# EAGLE design Soccer_Robot V1.1R (EAGLE 9.5.1)
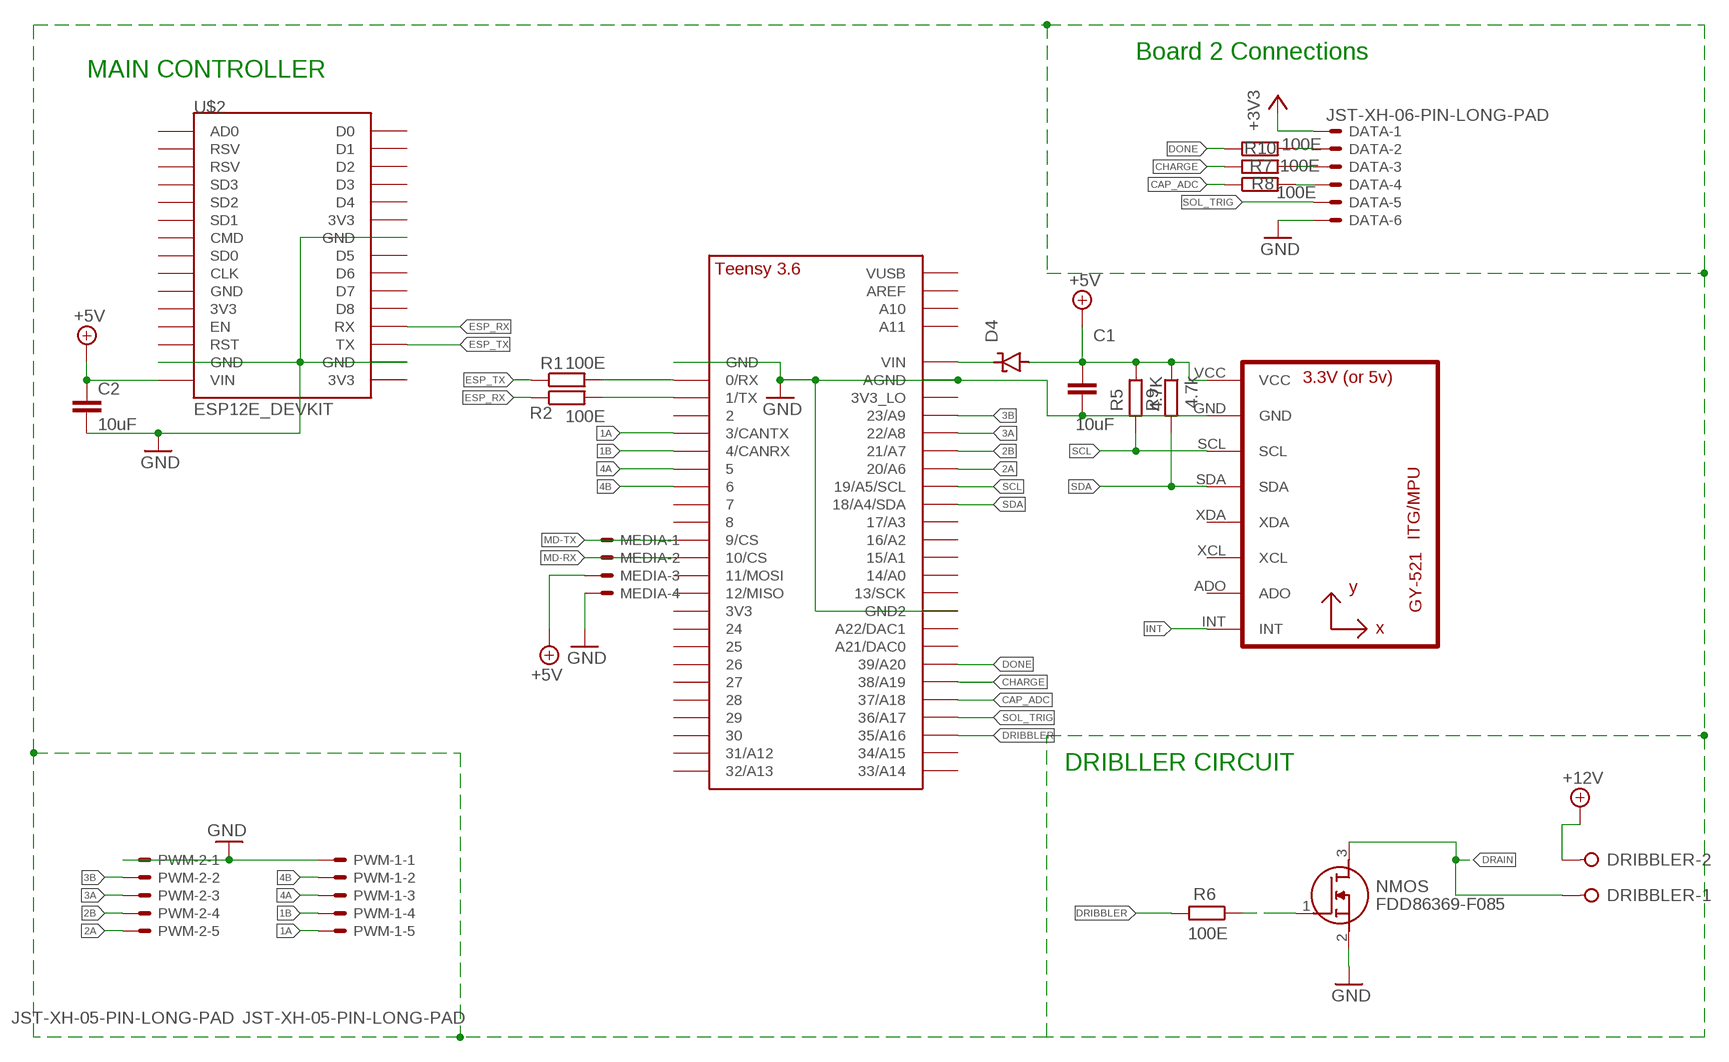
[diagram p0: schematic, sheet 1, part 1 of 2]
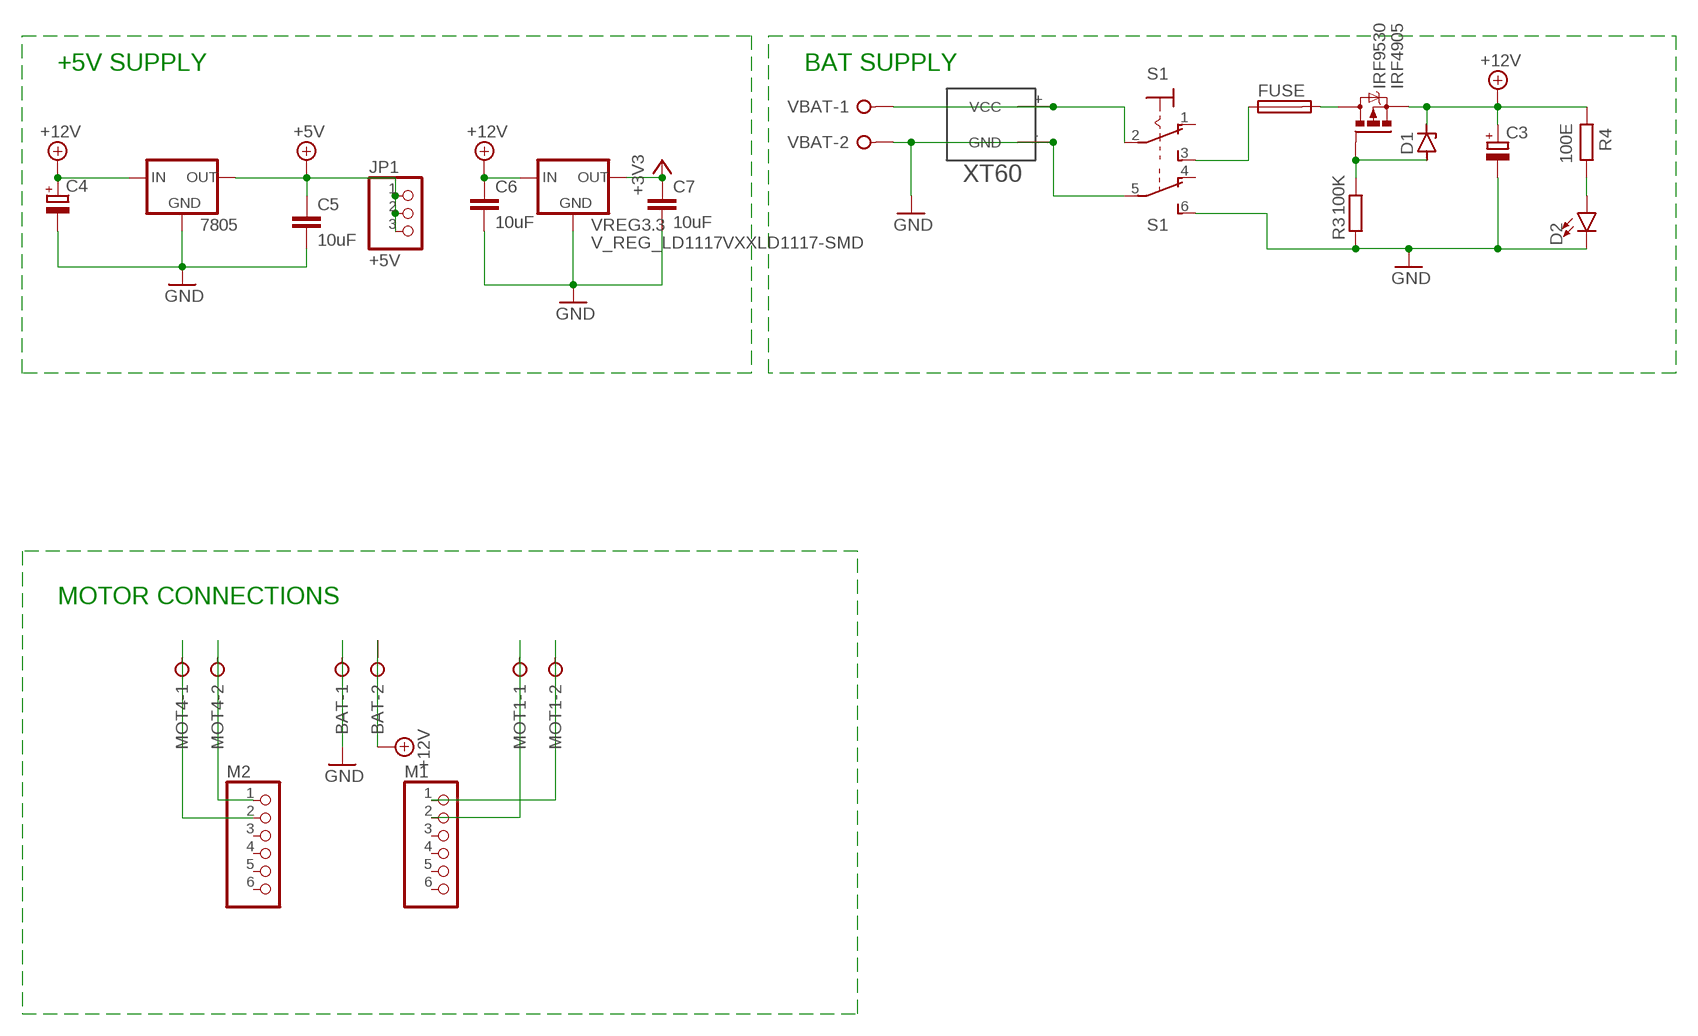
[diagram p1: schematic, sheet 1, part 2 of 2]

## Parts
7805  78XXS  [78XXS]
BAT  W237-02P  [W237-132]
C1  10uF  C-EUC1206  [C1206]
C2  10uF  C-EUC1206  [C1206]
C3  CPOL-EUE2.5-7  [E2,5-7]
C4  CPOL-EUE2.5-7  [E2,5-7]
C5  10uF  C-EUC1206  [C1206]
C6  10uF  C-EUC1206  [C1206]
C7  10uF  C-EUC1206  [C1206]
D1  ZENER-DIODEDO41Z10  [DO41Z10]
D2  LED5MM  [LED_5MM]
D4  SUPPRESSOR-SMBG  [SMBG]
DATA  JST-XH-06-PIN-LONG-PAD  [JST-XH-06-PACKAGE-LONG-PAD]
DRIBBLER  W237-02P  [W237-132]
FUSE  SH22,5A  [SH22,5A]
IRF4905  IRF9530  [TO220BV]
JP1  +5V  PINHD-1X3  [1X03]
M1  PINHD-1X6  [1X06]
M2  PINHD-1X6  [1X06]
MEDIA  JST-XH-04-PIN-LONG-PAD  [JST-XH-04-PACKAGE-LONG-PAD]
MOT1  W237-02P  [W237-132]
MOT4  W237-02P  [W237-132]
NMOS  FDD86369-F085  [DPAK3-CASE-369AS]
PWM-1  JST-XH-05-PIN-LONG-PAD  [JST-XH-05-PACKAGE-LONG-PAD]
PWM-2  JST-XH-05-PIN-LONG-PAD  [JST-XH-05-PACKAGE-LONG-PAD]
R1  100E  R-EU_M1206  [M1206]
R2  100E  R-EU_M1206  [M1206]
R3  100K  R-EU_M1206  [M1206]
R4  100E  R-EU_M1206  [M1206]
R5  4.7K  R-EU_M1206  [M1206]
R6  100E  R-EU_M1206  [M1206]
R7  100E  R-EU_M1206  [M1206]
R8  100E  R-EU_M1206  [M1206]
R9  4.7k  R-EU_M1206  [M1206]
R10  100E  R-EU_M1206  [M1206]
S1  320-938  [320-938]
U1  GY-521MPU6050  [GY-521]
U$1  TEENSY_3.5/3.6_BASIC  [TEENSY_3.5/3.6_BASIC]
U$2  ESP12E_DEVKIT  [ESP12E_DEVKIT]
VBAT  W237-02P  [W237-132]
VBAT2  XT60  [XT60]
VREG3.3  V_REG_LD1117VXXLD1117-SMD  [SOT223]

## Nets
1A: PWM-1.5 U$1.3/CANTX
1B: PWM-1.4 U$1.4/CANRX
2A: PWM-2.5 U$1.20/A6
2B: PWM-2.4 U$1.21/A7
3A: PWM-2.3 U$1.22/A8
3B: PWM-2.2 U$1.23/A9
4A: PWM-1.3 U$1.5
4B: PWM-1.2 U$1.6
+3V3: C7.1 DATA.1 VREG3.3.2(OUT) VREG3.3.4(OUT)
+5V: 7805.OUT C1.1 C2.1 C5.1 D4.A JP1.1 JP1.2 JP1.3 MEDIA.3 R5.1 R9.1 U1.VCC U$2.VIN
+12V: 7805.IN BAT.2 C3.+ C4.+ C6.1 D1.C DRIBBLER.2 IRF4905.S R4.2 VREG3.3.3(IN)
CAP_ADC: R8.1 U$1.37/A18
CHARGE: R7.1 U$1.38/A19
DONE: R10.1 U$1.39/A20
DRAIN: DRIBBLER.1 NMOS.3(D)
DRIBBLER: R6.2 U$1.35/A16
ESP_RX: R2.1 U$2.RX
ESP_TX: R1.1 U$2.TX
GND: 7805.GND BAT.1 C1.2 C2.2 C3.- C4.- C5.2 C6.2 C7.2 D2.K(C) DATA.6 MEDIA.4 NMOS.2(S) PWM-1.1 PWM-2.1 R3.1 S1.5(B:P) S1.6(B:S) U1.GND U$1.AGND U$1.GND U$1.GND2 U$2.GND@1(GND) U$2.GND@2(GND) U$2.GND@3(GND) VBAT2.-(GND) VBAT.2 VREG3.3.1(GND)
INT: U1.INT
MD-RX: MEDIA.2 U$1.10/CS
MD-TX: MEDIA.1 U$1.9/CS
N$2: R1.2 U$1.0/RX
N$3: R2.2 U$1.1/TX
N$4: DATA.2 R10.2
N$7: S1.2(1:P) VBAT2.+(VCC) VBAT.1
N$8: FUSE.2 IRF4905.D
N$16: NMOS.1(G) R6.1
N$19: D1.A IRF4905.G R3.2
N$26: D2.A R4.1
N$29: M1.1 MOT1.2
N$30: M1.2 MOT1.1
N$31: M2.1 MOT4.2
N$70: M2.2 MOT4.1
N$72: FUSE.1 S1.3(1:S)
N$73: DATA.3 R7.2
N$74: DATA.4 R8.2
N$75: D4.C U$1.VIN
SCL: R5.2 U1.SCL U$1.19/A5/SCL
SDA: R9.2 U1.SDA U$1.18/A4/SDA
SOL_TRIG: DATA.5 U$1.36/A17
Unconnected: M1.3 M1.4 M1.5 M1.6 M2.3 M2.4 M2.5 M2.6 S1.1(1:O) S1.4(B:O) U1.ADO U1.XCL U1.XDA U$1.2 U$1.3V3 U$1.3V3_LO U$1.7 U$1.8 U$1.11/MOSI U$1.12/MISO U$1.13/SCK U$1.14/A0 U$1.15/A1 U$1.16/A2 U$1.17/A3 U$1.21/DAC0(A21/DAC0) U$1.24 U$1.25 U$1.26 U$1.27 U$1.28 U$1.29 U$1.30 U$1.31/A12 U$1.32/A13 U$1.33/A14 U$1.34/A15 U$1.A10 U$1.A11 U$1.A22/DAC1 U$1.AREF U$1.VUSB U$2.3V3@0(3V3) U$2.3V3@1(3V3) U$2.3V3@2(3V3) U$2.AD0 U$2.CLK U$2.CMD U$2.D0 U$2.D1 U$2.D2 U$2.D3 U$2.D4 U$2.D5 U$2.D6 U$2.D7 U$2.D8 U$2.EN U$2.GND@0(GND) U$2.RST U$2.RSV@0(RSV) U$2.RSV@1(RSV) U$2.SD0 U$2.SD1 U$2.SD2 U$2.SD3

## Notes on the sheet
- Board 2 Connections
- MAIN CONTROLLER
- +5V SUPPLY | BAT SUPPLY
- MOTOR CONNECTIONS
- DRIBLLER CIRCUIT

## Library data of the parts
7805 = v-reg:78XXS: VOLTAGE REGULATOR
BAT DRIBBLER MOT1 MOT4 VBAT = con-wago-508:W237-02P: WAGO SREW CLAMP; OC_FARNELL: unknown; OC_NEWARK: unknown
C1 C2 C5-C7 = rcl:C-EU: CAPACITOR, European symbol; SPICEPREFIX: C
C3 C4 = rcl:CPOL-EU: POLARIZED CAPACITOR, European symbol; SPICEPREFIX: C
D1 = diode:ZENER-DIODE: Z-Diode
D2 = SparkFun-LED:LED: LED (Generic) Standard schematic elements and footprints for 5mm, 3mm, 1206, and 0603 sized LEDs. Generic LEDs with no color specified.
D4 = diode:SUPPRESSOR-: Suppressor diode
DATA = Rembrandt Electronics - JST XH Connectors v1-0:JST-XH-06-PIN: JST XH Connector 2 Pin Wire to board connector. Pitch: 2,54 mm, (0.100") Number of pins: 6 Created by Rembrandt Electronics www.rembrandtelectronics.com
FUSE = fuse:SH22,5A: FUSE HOLDER grid 22,5mm, isolated cap OGN0031 8201, Schurter (Buerklin); MPN: 0031.7701.11; OC_FARNELL: unknown; OC_NEWARK: 04F1224
IRF4905 = transistor-power:IRF9530: P-CHANNEL HEXFET POWER-MOS-FET Source: http://www.irf.com/product-info/datasheets/data/irf9530.pdf
JP1 = pinhead:PINHD-1X3: PIN HEADER
M1 M2 = pinhead:PINHD-1X6: PIN HEADER
MEDIA = Rembrandt Electronics - JST XH Connectors v1-0:JST-XH-04-PIN: JST XH Connector 2 Pin Wire to board connector. Pitch: 2,54 mm, (0.100") Number of pins: 4 Created by Rembrandt Electronics www.rembrandtelectronics.com
NMOS = FDD86369-F085:FDD86369-F085: MOSFET 80V 90A Dual DPAK N-Chnl PowerTrench Source: Datasheet <https://componentsearchengine.com/Datasheets/1/FDD86369-F085.pdf>; DESCRIPTION: MOSFET 80V 90A Dual DPAK N-Chnl PowerTrench; HEIGHT: mm; MANUFACTURER_NAME: ON Semiconductor; MANUFACTURER_PART_NUMBER: FDD86369-F085; MOUSER_PART_NUMBER: 512-FDD86369_F085; MOUSER_PRICE-STOCK: https://www.mouser.com/Search/Refine.aspx?Keyword=512-FDD86369_F085
PWM-1 PWM-2 = Rembrandt Electronics - JST XH Connectors v1-0:JST-XH-05-PIN: JST XH Connector 2 Pin Wire to board connector. Pitch: 2,54 mm, (0.100") Number of pins: 5 Created by Rembrandt Electronics www.rembrandtelectronics.com
R1-R10 = rcl:R-EU_: RESISTOR, European symbol; SPICEPREFIX: R
S1 = switch:320-938: TOGGLE SWITCH distributor RS Components
U1 = gy-521:GY-521
U$1 = Teensy356:TEENSY_3.5/3.6_BASIC
U$2 = ESP12E_DEVKIT:ESP12E_DEVKIT: ESP12E DEVKIT BOARD
VBAT2 = XT60:XT60: XT60
VREG3.3 = SparkFun-IC-Power:V_REG_LD1117VXX: LD1117VXX voltage regulator. We carry the 3.3V version (COM-00526) in TO-220 package.; PROD_ID: VREG-13917

## Board
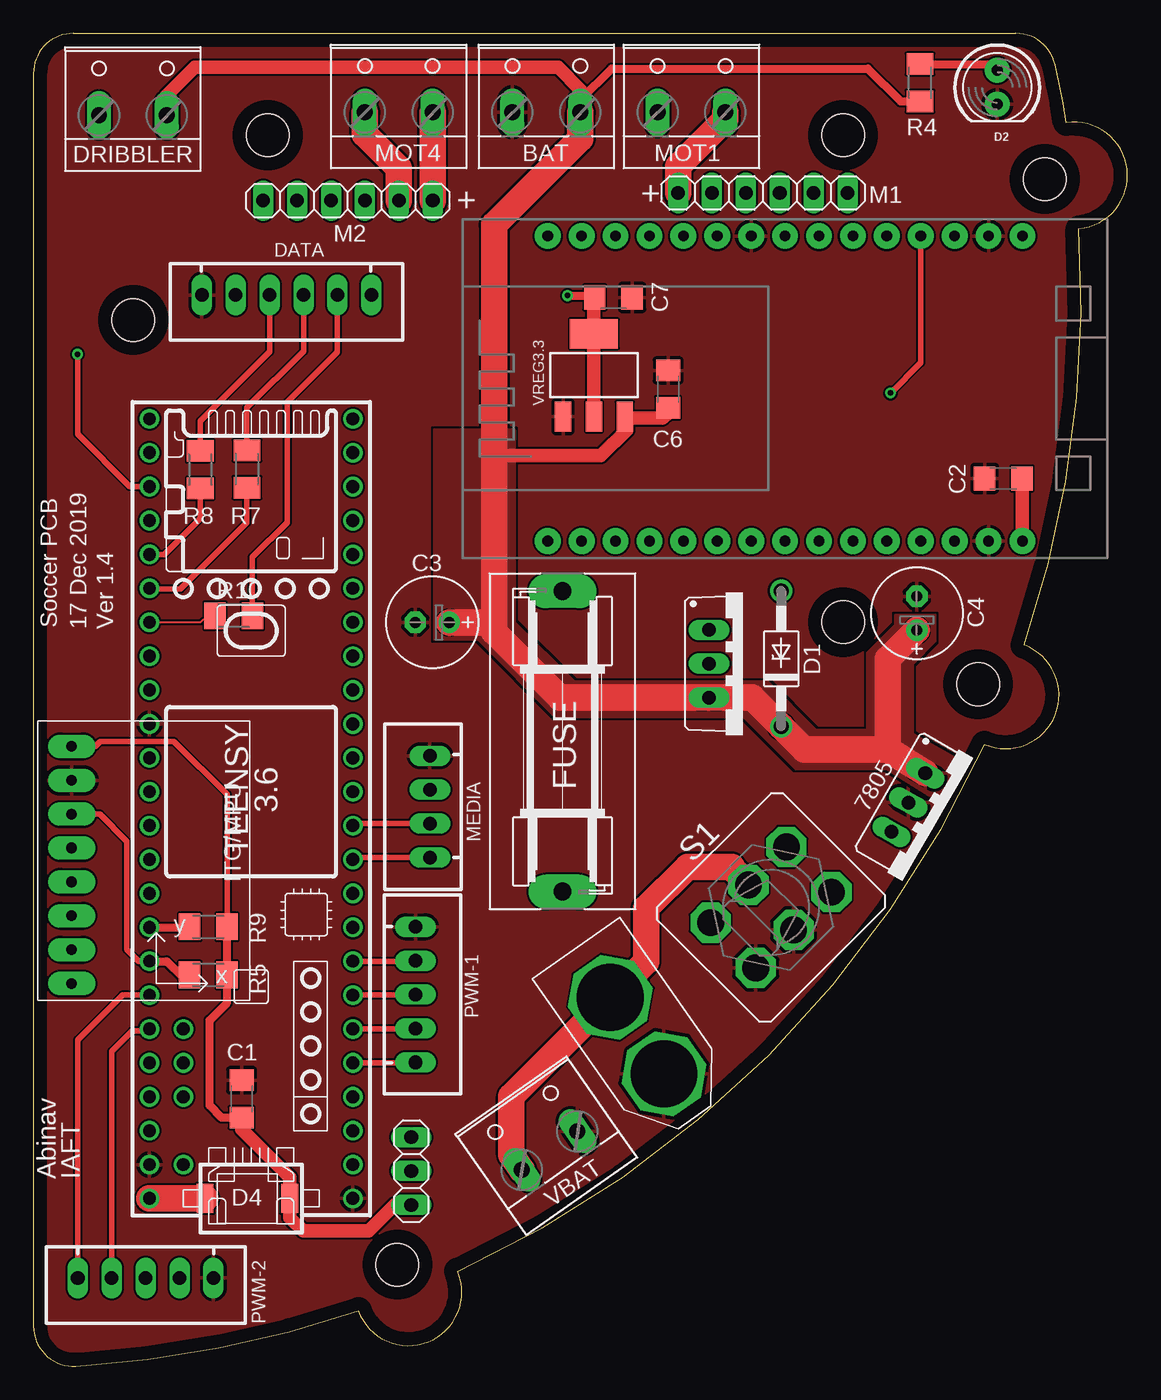
[diagram p2: board, top side]
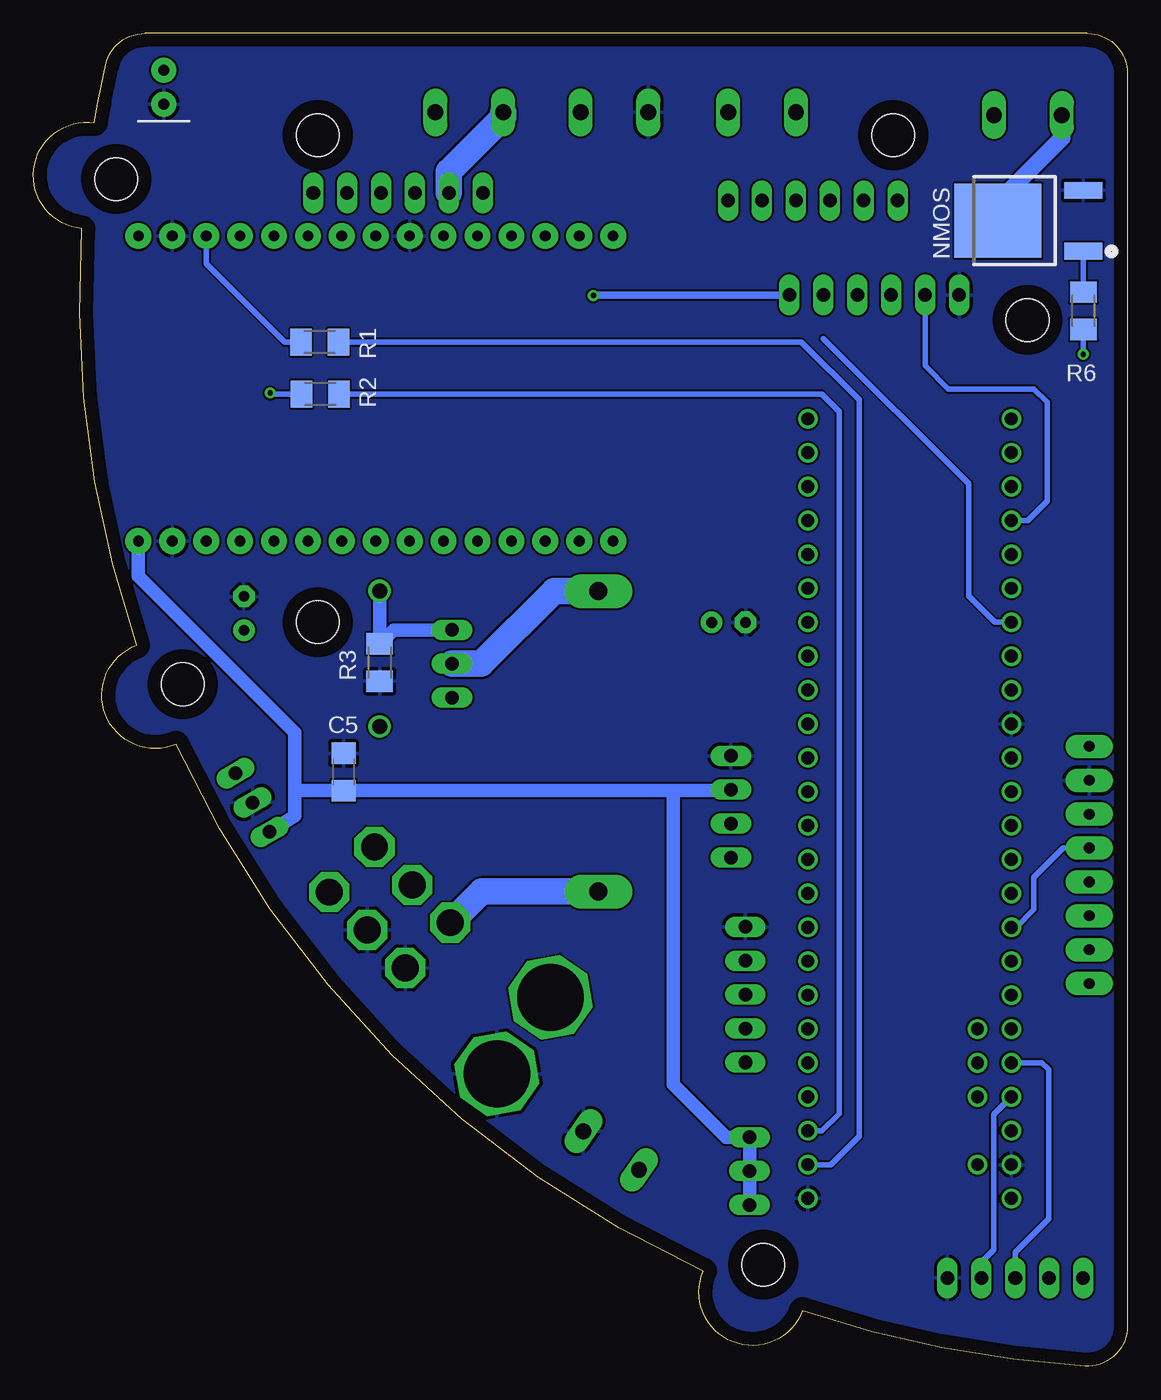
[diagram p3: board, bottom side, seen from below]

Size 81.95 x 99.87 mm. Coordinates in mm from the lower left corner, seen from the top.
Outline: 77.38,93.17 arc3 76.53,97.53 arc77 73.6,99.87 3,99.87 arc90 0,96.87 0,3 arc93 3.17,0 arc15 24.34,4.16 arc183 31.77,7.11 arc41 71.25,46.59 arc183 74.21,54.03 arc23 78.32,85.23 arc183 77.38,93.17
Copper layers (1*16): Top 0.035mm / dielectric 1.5mm / Bottom 0.035mm
Design rules "default *": minimum track width 6mil, minimum drill 0.35mm, track to track 6mil, track to pad 6mil, pad to pad 6mil, via to via 6mil, smd to smd 6mil, copper to edge 40mil, drill to drill 6mil, minimum pad ring 10mil, minimum via ring 8mil, stop-mask expansion 6mil, vias tented up to drill 0mil, thermal gap 10mil
Holes 3.2 mm at 7.49,78.39 60.65,92.24 70.76,51.1 27.27,7.61 17.55,92.24 60.65,55.74 75.74,88.96

### Footprints (pad centres in the part's own frame; a part is rotated, then mirrored left to right if it is on the bottom)
78XXS = drill 1.016 long: GND 0,-2.54; IN -2.54,-2.54; OUT 2.54,-2.54
W237-132 = drill 1.194 long: 1 -2.54,-0.635; 2 2.54,-0.635
C1206 = smd 1.6 x 1.8: 1 -1.4,0; 2 1.4,0
E2,5-7 = drill 0.813 pad 1.6: + -1.27,0 | drill 0.813 pad 1.6 octagon: - 1.27,0
DO41Z10 = drill 1.118: A 5.08,0; C -5.08,0
LED_5MM = drill 0.813 pad 1.88: A -1.27,0; K 1.27,0
SMBG = smd 1.27 x 2.16: A 3.17,0; C -3.17,0
JST-XH-06-PACKAGE-LONG-PAD = drill 1.016 long: 1 -6.35,0; 2 -3.81,0; 3 -1.27,0; 4 1.27,0; 5 3.81,0; 6 6.35,0
SH22,5A = drill 1.321 pad 2.54 long: 1 -11.252,0; 2 11.252,0
TO220BV = drill 1.016 long: D 0,-2.54; G -2.54,-2.54; S 2.54,-2.54
1X03 = drill 1.016 long: 1 -2.54,0; 2 0,0; 3 2.54,0
1X06 = drill 1.016 long: 1 -6.35,0; 2 -3.81,0; 3 -1.27,0; 4 1.27,0; 5 3.81,0; 6 6.35,0
JST-XH-04-PACKAGE-LONG-PAD = drill 1.016 long: 1 -3.81,0; 2 -1.27,0; 3 1.27,0; 4 3.81,0
DPAK3-CASE-369AS = smd 1.25 x 2.85: 1 -2.28,-6.4; 2 2.28,-6.4 | smd 5.55 x 6.5: 3 0,0
JST-XH-05-PACKAGE-LONG-PAD = drill 1.016 long: 1 -5.08,0; 2 -2.54,0; 3 0,0; 4 2.54,0; 5 5.08,0
M1206 = smd 1.6 x 2: 1 -1.4,0; 2 1.4,0
320-938 = drill 2.007 octagon: 1 -2.388,4.013; 2 -2.388,0; 3 -2.388,-4.013; 4 2.388,4.013; 5 2.388,0; 6 2.388,-4.013
GY-521 = drill 0.8 pad 1.778 long: ADO -8.89,-6.35; GND -8.89,6.35; INT -8.89,-8.89; SCL -8.89,3.81; SDA -8.89,1.27; VCC -8.89,8.89; XCL -8.89,-3.81; XDA -8.89,-1.27
TEENSY_3.5/3.6_BASIC = drill 0.965: 0/RX -25.4,-7.62; 1/TX -22.86,-7.62; 2 -20.32,-7.62; 3/CANTX -17.78,-7.62; 3V3 7.62,-7.62; 3V3_LO -22.86,7.62; 4/CANRX -15.24,-7.62; 5 -12.7,-7.62; 6 -10.16,-7.62; 7 -7.62,-7.62; 8 -5.08,-7.62; 9/CS -2.54,-7.62; 10/CS 0,-7.62; 11/MOSI 2.54,-7.62; 12/MISO 5.08,-7.62; 13/SCK 5.08,7.62; 14/A0 2.54,7.62; 15/A1 0,7.62; 16/A2 -2.54,7.62; 17/A3 -5.08,7.62; 18/A4/SDA -7.62,7.62; 19/A5/SCL -10.16,7.62; 20/A6 -12.7,7.62; 21/A7 -15.24,7.62; 21/DAC0 12.7,7.62; 22/A8 -17.78,7.62; 23/A9 -20.32,7.62; 24 10.16,-7.62; 25 12.7,-7.62; 26 15.24,-7.62; 27 17.78,-7.62; 28 20.32,-7.62; 29 22.86,-7.62; 30 25.4,-7.62; 31/A12 27.94,-7.62; 32/A13 30.48,-7.62; 33/A14 30.48,7.62; 34/A15 27.94,7.62; 35/A16 25.4,7.62; 36/A17 22.86,7.62; 37/A18 20.32,7.62; 38/A19 17.78,7.62; 39/A20 15.24,7.62; A10 -17.78,5.08; A11 -15.24,5.08; A22/DAC1 10.16,7.62; AGND -25.4,7.62; AREF -20.32,5.08; GND -27.94,-7.62; GND2 7.62,7.62; VIN -27.94,7.62; VUSB -25.4,5.08
ESP12E_DEVKIT = drill 0.8 pad 1.93: 3V3@0 -11.43,-7.62; 3V3@1 11.43,5.08; 3V3@2 11.43,-17.78; AD0 -11.43,17.78; CLK -11.43,-2.54; CMD -11.43,2.54; D0 11.43,17.78; D1 11.43,15.24; D2 11.43,12.7; D3 11.43,10.16; D4 11.43,7.62; D5 11.43,0; D6 11.43,-2.54; D7 11.43,-5.08; D8 11.43,-7.62; EN -11.43,-10.16; GND@0 -11.43,-5.08; GND@1 -11.43,-15.24; GND@2 11.43,2.54; GND@3 11.43,-15.24; RST -11.43,-12.7; RSV@0 -11.43,15.24; RSV@1 -11.43,12.7; RX 11.43,-10.16; SD0 -11.43,0; SD1 -11.43,5.08; SD2 -11.43,7.62; SD3 -11.43,10.16; TX 11.43,-12.7; VIN -11.43,-17.78
XT60 = drill 5 octagon: + 4.5,0; - 11.5,0
SOT223 = smd 1.219 x 2.235: 1 -2.311,-3.099; 2 0,-3.099; 3 2.311,-3.099 | smd 3.6 x 2.2: 4 0,3.099

### Placement (x,y rotation side)
7805  67.74,40.96 240 top
BAT  38.43,94.58 0 top
C1  15.6,20.02 90 top
C2  72.66,66.51 180 top
C3  29.88,55.73 180 top
C4  66.18,56.41 90 top
C5  58.72,44.52 90 bottom
C6  47.55,73.21 90 top
C7  43.45,80.08 0 top
D1  56.02,53.01 90 top
D2  72.2,95.82 270 top
D4  16.03,12.56 0 top
DATA  18.97,80.26 180 top
DRIBBLER  7.46,94.38 0 top
FUSE  39.64,46.82 90 top
IRF4905  53.15,52.63 270 top
JP1  28.31,14.62 90 top
M1  54.64,87.91 0 top
M2  23.57,87.33 180 top
MEDIA  29.71,41.92 90 top
MOT1  49.3,94.58 0 top
MOT4  27.37,94.58 0 top
NMOS  9.71,85.82 90 bottom
PWM-1  28.63,27.84 270 top
PWM-2  8.41,6.6 180 top
R1  60.51,76.73 0 bottom
R2  60.46,72.83 0 bottom
R3  56.02,52.72 90 bottom
R4  66.42,96.17 270 top
R5  13.11,29.32 180 top
R6  3.3,79.07 270 bottom
R7  16,67.22 90 top
R8  12.5,67.17 90 top
R9  13.11,32.92 180 top
R10  15.01,56.22 0 top
S1  55.26,34.37 315 top
U1  11.76,37.55 0 top
U$1  16.32,40.5 90 top
U$2  56.31,73.25 90 top
VBAT  38.31,16.67 35 top
VBAT2  40.64,31.32 305 top
VREG3.3  41.99,74.25 0 top

### Tracks (layer width: path | path; a pad name or v marks a point on that pad's centre or on a via)
1A
  Top 0.406: U$1.3/CANTX 28.59,22.72 PWM-1.5
1B
  Top 0.406: U$1.4/CANRX 28.59,25.26 PWM-1.4
2A
  Top 0.406: PWM-2.5 3.33,24.44 6.69,27.8 U$1.20/A6
2B
  Top 0.406: U$1.21/A7 8.56,25.12 7.41,25.12 5.87,23.58 PWM-2.4
3A
  Bottom 0.406: U$1.22/A8 6.41,22.72 5.91,22.22 5.91,11.02 8.41,8.52 PWM-2.3
3B
  Bottom 0.406: U$1.23/A9 10.01,18.87 10.01,8.72 10.95,7.78 PWM-2.2
4A
  Top 0.406: U$1.5 28.59,27.8 PWM-1.3
4B
  Top 0.406: U$1.6 28.59,30.34 PWM-1.2
+3V3  (via drill 0.4)
  Top 0.61: v40.01,80.22 41.91,80.22 C7.1
  Top 1.016: C7.1 41.99,80.02 VREG3.3.4 VREG3.3.2
  Bottom 0.61: DATA.1 v40.01,80.22
+5V
  Top 0.406: R9.1 14.51,42.82 10.51,46.82 5.01,46.82 4.63,46.44 U1.VCC
  Top 0.61: R9.1 R5.1 14.51,27.22 13.21,25.92 13.21,19.52 14.11,18.62 C1.1
  Top 1.016: JP1.1 27.07,12.08 25.11,10.12 20.21,10.12 19.2,11.13 D4.A 19.2,14.13 15.6,17.73 C1.1 | U$2.VIN 74.06,61.85 C2.1
  Bottom 1.016: 7805.OUT 62.36,41.24 62.36,43.12 | 34.01,43.12 C5.1 62.36,43.12 | 34.01,43.12 29.78,43.12 MEDIA.3 | 34.01,43.12 34.01,21.12 30.05,17.16 JP1.3 JP1.2 JP1.1 | U$2.VIN 74.09,59.2 62.36,47.48 62.36,43.12
+12V
  Top 0.61: BAT.2 40.97,94.88 43.31,97.22 62.51,97.22 64.96,94.77 R4.2
  Top 1.016: DRIBBLER.2 10.01,93.76 10.01,95.22 12.11,97.32 39.31,97.32 40.97,95.66 BAT.2 | C6.1 47.55,71.46 47.11,71.02 44.43,71.02 | 44.43,71.02 VREG3.3.3 | 34.51,68.22 42.51,68.22 44.43,70.15 44.43,71.02
  Top 2: 64.01,46.22 57.73,46.22 D1.C 53.86,50.09 IRF4905.S 39.44,50.09 34.51,55.02 34.51,55.73 | BAT.2 40.97,91.98 34.51,85.52 34.51,68.22 34.51,55.73 | C3.+ 34.51,55.73 | 7805.IN 64.01,46.22 | C4.+ 64.01,52.97 64.01,46.22
  pour Top: 30.01,70.22 30.01,54.42 33.31,54.42 39.11,48.62 53.21,48.62 57.11,44.72 63.91,44.72 67.11,42.72 68.01,42.22 69.61,45.32 65.91,47.42 65.91,52.62 67.61,54.32 67.61,56.32 64.51,56.32 64.51,55.52 62.41,53.42 62.41,47.72 58.61,47.72 55.01,51.32 40.51,51.32 36.11,55.72 36.11,70.12 36.01,70.22
CAP_ADC
  Top 0.406: U$1.37/A18 9.81,60.82 12.5,63.51 R8.1
CHARGE
  Top 0.406: R7.1 16,63.21 11.01,58.22 8.76,58.22 U$1.38/A19
DONE
  Top 0.152: U$1.39/A20 12.53,55.74 13.01,56.22 R10.1
  Bottom 0.406: U$1.39/A20 9.93,55.74 11.91,57.72 11.91,66.12 22.78,76.99
DRAIN
  Bottom 1.016: 9.71,87.52 9.71,87.22 NMOS.3
  Bottom 1.27: NMOS.3 9.01,86.52 | 9.71,87.22 4.92,92.01 DRIBBLER.1
DRIBBLER  (via drill 0.4)
  Top 0.406: U$1.35/A16 7.23,65.9 3.31,69.82 v3.31,75.82
  Bottom 0.406: v3.31,75.82 R6.2
ESP_RX  (via drill 0.4)
  Top 0.406: U$2.RX 66.47,75.18 v64.21,72.92
  Bottom 0.406: v64.21,72.92 64.12,72.83 R2.1
ESP_TX
  Bottom 0.406: R1.1 63.12,76.73 69.01,82.62 U$2.TX
GND
  pour Bottom (rank 4): -1.99,-0.78 -1.99,104.22 84.01,104.22 84.01,-0.78
  pour Top (rank 4): -3.99,1.22 -3.99,105.22 84.01,105.22 84.01,2.22 84.01,-0.78 -2.99,-0.78 -3.99,0.22
MD-RX
  Top 0.406: U$1.10/CS 24.09,40.65 MEDIA.2
MD-TX
  Top 0.406: U$1.9/CS 24.09,38.11 MEDIA.1
N$2
  Bottom 0.406: U$1.0/RX 22.23,15.1 20.11,17.22 20.11,72.42 24.42,76.73 R1.2
N$3
  Bottom 0.406: U$1.1/TX 22.89,17.64 21.61,18.92 21.61,71.52 22.92,72.83 R2.2
N$4
  Top 0.406: R10.2 16.41,60.62 19.01,63.22 19.01,72.22 22.78,75.99 DATA.2
N$7
  Top 2: VBAT.1 35.81,15.82 35.81,20.23 VBAT2.+ 45.91,30.33 45.91,34.32 49.01,37.42 52.31,37.42 52.31,37.32 S1.2
N$8
  Bottom 2: IRF4905.D 48.4,52.63 42.95,58.07 FUSE.2
N$16
  Bottom 0.406: NMOS.1 R6.1
N$19
  Bottom 1.016: IRF4905.G 54.97,55.17 R3.2 D1.A
N$26
  Top 0.61: R4.1 71.72,97.57 D2.A
N$29
  Top 2: M1.1 48.29,89.9 51.84,93.45 MOT1.2
N$30
  Bottom 2: M1.2 50.83,89.5 46.76,93.57 MOT1.1
N$31
  Top 2: M2.1 MOT4.2
N$70
  Top 2: M2.2 27.38,89.75 24.83,92.3 MOT4.1
N$72
  Bottom 2: FUSE.1 48.38,35.57 S1.3
N$73
  Top 0.406: DATA.3 20.24,76.05 16,71.81 R7.2
N$74
  Top 0.406: R8.2 12.5,70.81 17.71,76.02 DATA.4
N$75
  Top 2: U$1.VIN D4.C
SCL
  Top 0.406: U1.SCL 4.97,41.36 7.01,39.32 7.01,31.22 7.89,30.34 U$1.19/A5/SCL
  Top 0.61: U$1.19/A5/SCL 9.99,30.34 11.11,29.22 11.61,29.22 R5.2
SDA
  Top 0.61: R9.2 11.67,32.88 U$1.18/A4/SDA
  Bottom 0.406: U1.SDA 4.81,38.82 7.01,36.62 7.01,34.22 8.35,32.88 U$1.18/A4/SDA
SOL_TRIG
  Bottom 0.406: DATA.5 15.16,74.97 13.41,73.22 7.01,73.22 6.01,72.22 6.01,64.82 7.47,63.36 U$1.36/A17

### Text on the board
tNames: + | + | Soccer PCB | 17 Dec 2019 | Ver 1.4 | Abinav | IAFT